# EAGLE design H18R10 (EAGLE 9.6.2)

## Sheet 1 of 2
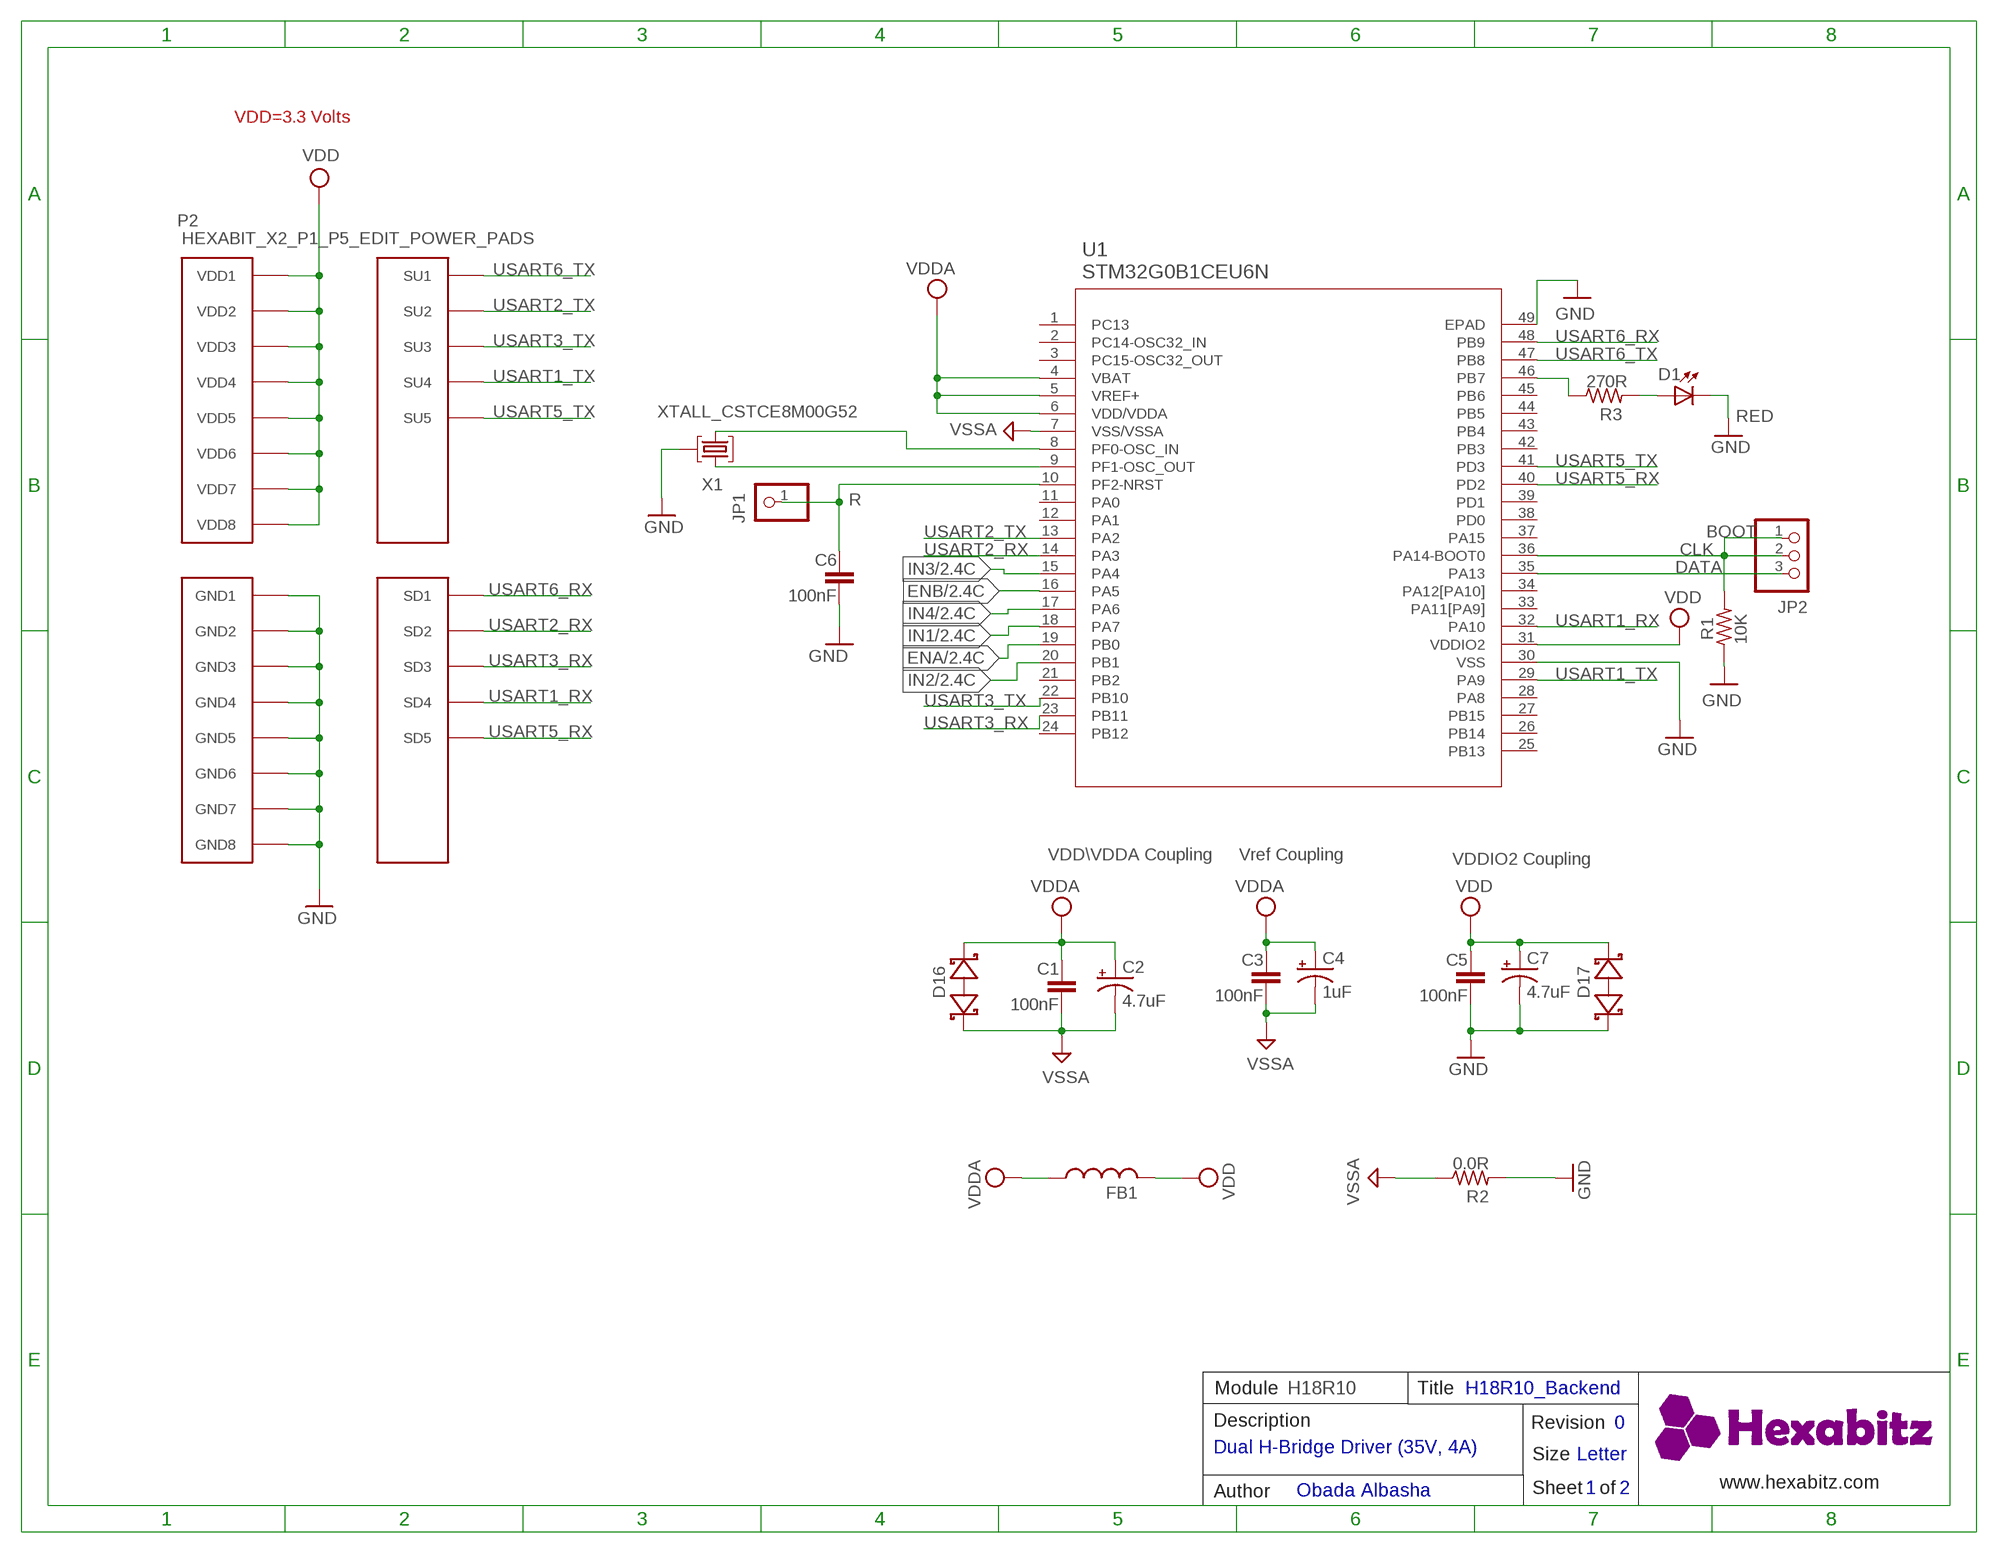
[diagram p0: schematic, sheet 1]

### Parts
C1  100nF  C-0603  [C-0603]
C2  4.7uF  C-0805-POL  [C-0805-POL]
C3  100nF  C-0603  [C-0603]
C4  1uF  C-0805-POL  [C-0805-POL]
C5  100nF  C-0603  [C-0603]
C6  100nF  C-0603  [C-0603]
C7  4.7uF  C-0805-POL  [C-0805-POL]
D1  RED  VLMS1300-GS08  [VLMS1300-GS08]
D16  BOURNS_CDSOD323-T03SCBOURNS_CDSOD323-T03SC_0_0  [BOURNS_CDSOD323-T03SC_0]
D17  BOURNS_CDSOD323-T03SCBOURNS_CDSOD323-T03SC_0_0  [BOURNS_CDSOD323-T03SC_0]
FB1  FB-0603  [FB-0603]
JP1  R  PINHD-1X1  [1X01]
JP2  PINHD-1X3  [1X03]
P2  HEXABIT_X2_P1_P5_EDIT_POWER_PADS  [HEXABIT_X2_P1_P5_EDIT_POWER_PADS]
R1  10K  R-0603  [R-0603]
R2  0.0R  R-0603  [R-0603]
R3  270R  R-0603  [R-0603]
U1  STM32G0B1CEU6N  [HEXABITZ_ICS_QFN_B1CEU6_STM-L]
X1  XTALL_CSTCE8M00G52  [XTALL_CSTCE8M00G52]

### Nets
CLK: JP2.1 JP2.2 R1.2 U1.36(PA14-BOOT0)
DATA: JP2.3 U1.35(PA13)
ENA: U1.19(PB0) ; also sheet 2
ENB: U1.16(PA5) ; also sheet 2
GND: C5.2 C6.2 C7.2(-) D1.C D17.1(A) P2.PAD_PD11(GND1) P2.PAD_PD12(GND2) P2.PAD_PD13(GND3) P2.PAD_PD14(GND4) P2.PAD_PD17(GND5) P2.PAD_PD18(GND6) P2.PAD_PD19(GND7) P2.PAD_PD20(GND8) R1.1 R2.2 U1.30(VSS) U1.49(EPAD) X1.P$2
IN1: U1.18(PA7) ; also sheet 2
IN2: U1.20(PB1) ; also sheet 2
IN3: U1.15(PA4) ; also sheet 2
IN4: U1.17(PA6) ; also sheet 2
N$1: D1.A R3.2
N$2: R3.1 U1.46(PB7)
N$5: U1.9(PF1-OSC_OUT) X1.P$1
N$6: U1.8(PF0-OSC_IN) X1.P$3
N$8: C6.1 JP1.1 U1.10(PF2-NRST)
USART1_RX: P2.PAD_PD4(SD4) U1.32(PA10)
USART1_TX: P2.PAD_PU4(SU4) U1.29(PA9)
USART2_RX: P2.PAD_PD2(SD2) U1.14(PA3)
USART2_TX: P2.PAD_PU2(SU2) U1.13(PA2)
USART3_RX: P2.PAD_PD3(SD3) U1.23(PB11)
USART3_TX: P2.PAD_PU3(SU3) U1.22(PB10)
USART5_RX: P2.PAD_PD5(SD5) U1.40(PD2)
USART5_TX: P2.PAD_PU5(SU5) U1.41(PD3)
USART6_RX: P2.PAD_PD1(SD1) U1.48(PB9)
USART6_TX: P2.PAD_PU1(SU1) U1.47(PB8)
VDD: C5.1 C7.1(+) D17.2(C) FB1.2 P2.PAD_PU11(VDD1) P2.PAD_PU12(VDD2) P2.PAD_PU13(VDD3) P2.PAD_PU14(VDD4) P2.PAD_PU17(VDD5) P2.PAD_PU18(VDD6) P2.PAD_PU19(VDD7) P2.PAD_PU20(VDD8) U1.31(VDDIO2)
VDDA: C1.1 C2.1(+) C3.1 C4.1(+) D16.2(C) FB1.1 U1.4(VBAT) U1.5(VREF+) U1.6(VDD/VDDA) ; also sheet 2
VSSA: C1.2 C2.2(-) C3.2 C4.2(-) D16.1(A) R2.1 U1.7(VSS/VSSA) ; also sheet 2
Unconnected: U1.1(PC13) U1.2(PC14-OSC32_IN) U1.3(PC15-OSC32_OUT) U1.11(PA0) U1.12(PA1) U1.21(PB2) U1.24(PB12) U1.25(PB13) U1.26(PB14) U1.27(PB15) U1.28(PA8) U1.33(PA11[PA9]) U1.34(PA12[PA10]) U1.37(PA15) U1.38(PD0) U1.39(PD1) U1.42(PB3) U1.43(PB4) U1.44(PB5) U1.45(PB6)

### Notes on the sheet
- VDD=3.3 Volts
- BOOT
- VDD\VDDA Coupling | Vref Coupling | VDDIO2 Coupling
- Module | H18R10 | Title | H18R10_Backend
- Description | Revision | 0
- Dual H-Bridge Driver (35V, 4A)
- Size | Letter
- www.hexabitz.com
- Author | Obada Albasha | Sheet   of | 1 | 2
- C:/Users/Admin/Desktop/logodraft.bmp

## Sheet 2 of 2
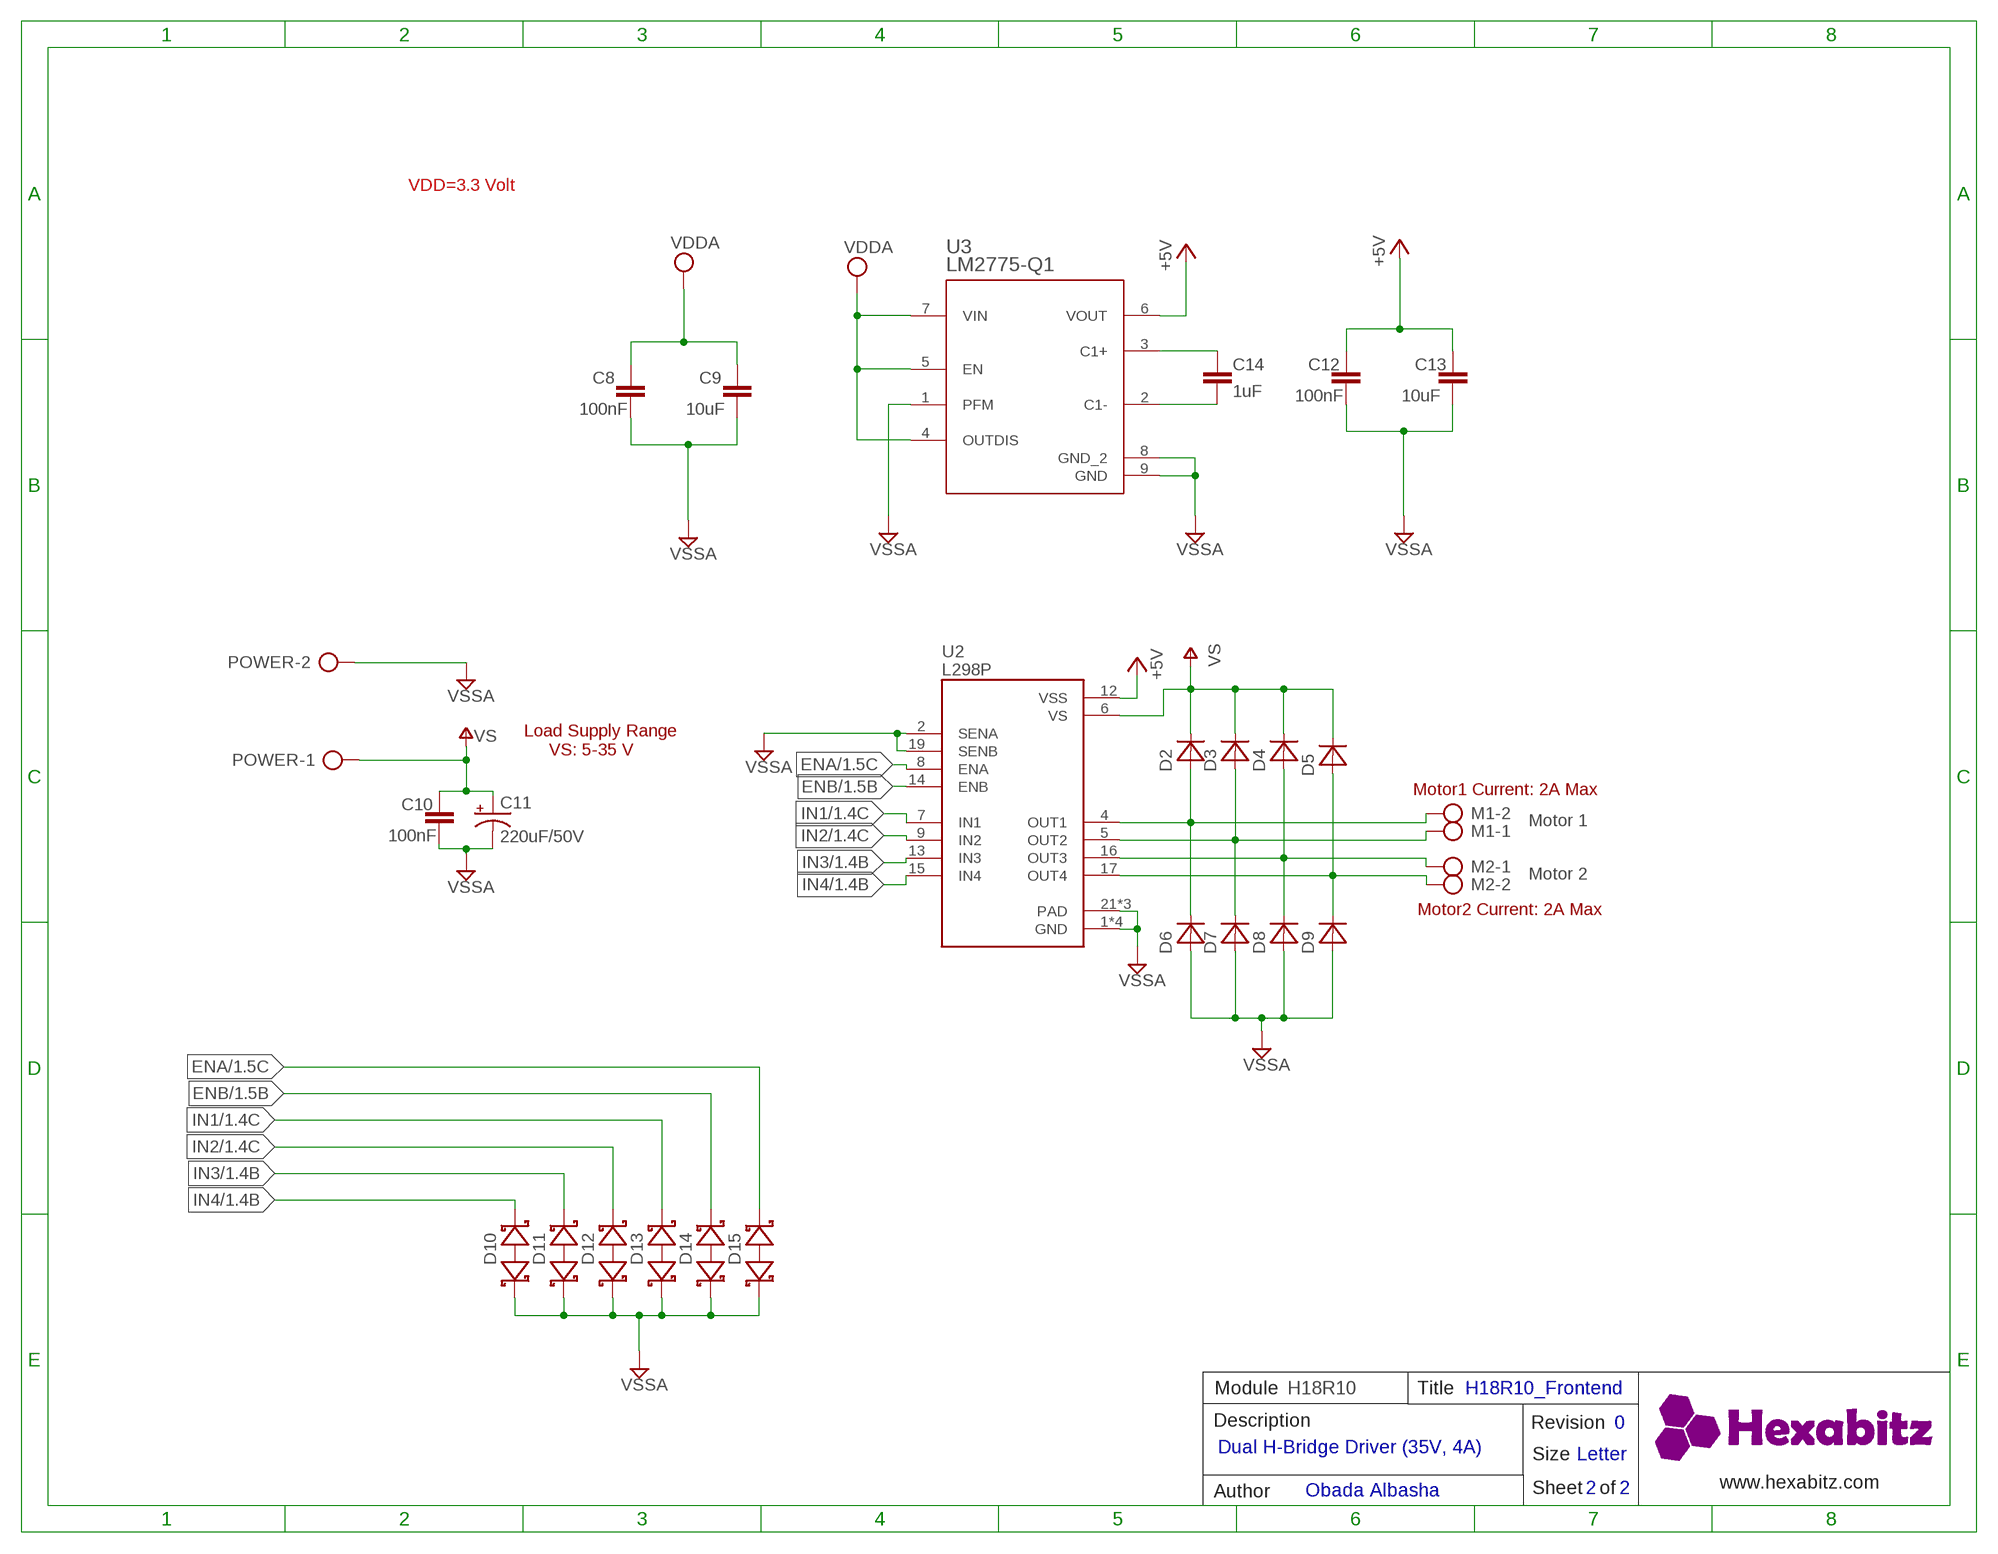
[diagram p1: schematic, sheet 2]

### Parts
C8  100nF  C-0603  [C-0603]
C9  10uF  C-0603  [C-0603]
C10  100nF  C-0603  [C-0603]
C11  220uF/50V  CPOL-USTT5D10  [TT5D10]
C12  100nF  C-0603  [C-0603]
C13  10uF  C-0603  [C-0603]
C14  1uF  C-0603  [C-0603]
D2  DIOD-SOD-123  [SOD123]
D3  DIOD-SOD-123  [SOD123]
D4  DIOD-SOD-123  [SOD123]
D5  DIOD-SOD-123  [SOD123]
D6  DIOD-SOD-123  [SOD123]
D7  DIOD-SOD-123  [SOD123]
D8  DIOD-SOD-123  [SOD123]
D9  DIOD-SOD-123  [SOD123]
D10  BOURNS_CDSOD323-T03SCBOURNS_CDSOD323-T03SC_0_0  [BOURNS_CDSOD323-T03SC_0]
D11  BOURNS_CDSOD323-T03SCBOURNS_CDSOD323-T03SC_0_0  [BOURNS_CDSOD323-T03SC_0]
D12  BOURNS_CDSOD323-T03SCBOURNS_CDSOD323-T03SC_0_0  [BOURNS_CDSOD323-T03SC_0]
D13  BOURNS_CDSOD323-T03SCBOURNS_CDSOD323-T03SC_0_0  [BOURNS_CDSOD323-T03SC_0]
D14  BOURNS_CDSOD323-T03SCBOURNS_CDSOD323-T03SC_0_0  [BOURNS_CDSOD323-T03SC_0]
D15  BOURNS_CDSOD323-T03SCBOURNS_CDSOD323-T03SC_0_0  [BOURNS_CDSOD323-T03SC_0]
M1  AK500/2  [AK500/2]
M2  AK500/2  [AK500/2]
POWER  AK500/2  [AK500/2]
U2  L298P  [SOIC127P1420X360-20N]
U3  LM2775-Q1  LM2775QDSGRQ1  [DSG0008A]

### Nets
+5V: C12.1 C13.1 U2.12(VSS) U3.6(VOUT)
ENA: D15.2(C) U2.8(ENA) ; also sheet 1
ENB: D14.2(C) U2.14(ENB) ; also sheet 1
IN1: D13.2(C) U2.7(IN1) ; also sheet 1
IN2: D12.2(C) U2.9(IN2) ; also sheet 1
IN3: D11.2(C) U2.13(IN3) ; also sheet 1
IN4: D10.2(C) U2.15(IN4) ; also sheet 1
N$3: C14.2 U3.2(C1-)
N$4: C14.1 U3.3(C1+)
N$7: D5.1(A) D9.2(C) M2.2 U2.17(OUT4)
N$13: D3.1(A) D7.2(C) M1.1 U2.5(OUT2)
N$14: D4.1(A) D8.2(C) M2.1 U2.16(OUT3)
N$15: D2.1(A) D6.2(C) M1.2 U2.4(OUT1)
V+: C10.1 C11.+ D2.2(C) D3.2(C) D4.2(C) D5.2(C) POWER.1 U2.6(VS) ; supply symbol labelled VS
VDDA: C8.1 C9.1 U3.4(OUTDIS) U3.5(EN) U3.7(VIN) ; also sheet 1
VSSA: C8.2 C9.2 C10.2 C11.- C12.2 C13.2 D6.1(A) D7.1(A) D8.1(A) D9.1(A) D10.1(A) D11.1(A) D12.1(A) D13.1(A) D14.1(A) D15.1(A) POWER.2 U2.1(GND) U2.2(SENA) U2.10(GND) U2.11(GND) U2.19(SENB) U2.20(GND) U2.21(PAD) U2.22(PAD) U2.23(PAD) U3.1(PFM) U3.8(GND_2) U3.9(GND) ; also sheet 1

### Notes on the sheet
- VDD=3.3 Volt
- Load Supply Range
       VS: 5-35 V
- Motor1 Current: 2A Max
- Motor 1
- Motor 2
- Motor2 Current: 2A Max
- Module | H18R10 | Title | H18R10_Frontend
- Description | Revision | 0
- Dual H-Bridge Driver (35V, 4A)
- Size | Letter
- www.hexabitz.com
- Author | Obada Albasha | Sheet   of | 2 | 2
- C:/Users/Admin/Desktop/logodraft.bmp

## Library data of the parts
C1 C3 C5 C6 C8-C10 C12-C14 = HEXABITZ_RCLS:C-0603: CAP CER 10% X7R 0603
C2 C4 C7 = HEXABITZ_RCLS:C-0805-POL: Cap Tant Solid SMD 2012
C11 = rcl:CPOL-US: POLARIZED CAPACITOR, American symbol; SPICEPREFIX: C
D1 = Hexabitz:VLMS1300-GS08: Red 0603 130° Clear 54 mcd 2 V Surface Mount ChipLED ; Octopart Url : http://octopart.com/vlms1300-gs08-vishay-21709201; MFN: Vishay; MPN: VLMS1300-GS08; OCTOPART_URL: https://octopart.com/vlms1300-gs08-vishay-21709201?r=sp&s=_gcP4_q8T1SC6PJQPTQ9yA
D2-D9 = HEXABITZ_RCLS:DIOD-SOD-123: 1.0 A Surface Mount Schottky Barrier Rectifier, 40 V, -65 to 125 degC, 2-Pin SOD-123 Package, RoHS, Tape and Reel
D10-D17 = HEXABITZ_RCLS:BOURNS_CDSOD323-T03SC: CDSOD323-TxxSC - TVS Diode Series; DESCRIPTION: Dio Tvs Vwm 03V 500W Bidir Sod323 / Tape & Reel - 7" Reel; MFN: Bourns; MPN: CDSOD323-T03SC; OCTOPART_URL: https://octopart.com/cdsod323-t03sc-bourns-10487153?r=sp
FB1 = HEXABITZ_RCLS:FB-0603: Ferrite Beads Multi-Layer 0603
JP1 = HEXABITZ_USER_INTERFACE_PARTS:PINHD-1X1: PIN HEADER; MFN: TE Connectivity; MPN: 87227-1; OCTOPART_URL: https://octopart.com/87227-1-te+connectivity-39512052?r=sp
JP2 = pinhead:PINHD-1X3: PIN HEADER
M1 M2 POWER = HEXABITZ_CONNECTION_PARTS:AK500/2: CONNECTOR; MFN: TE Connectivity; MPN: 282836-2; OCTOPART_URL: https://octopart.com/282836-2-te+connectivity-39396934?r=sp
P2 = hexabitz_connectors:HEXABIT_X2_P1_P5_EDIT_POWER_PADS
R1-R3 = HEXABITZ_RCLS:R-0603: Thick Film Resistors - SMD 0603
U1 = HEXABITZ_ICs:STM32G0B1CEU6N
U2 = HEXABITZ_ICs:L298P: L298 Series Dual Full Bridge 4 A 46 V Driver Surface Mount - PowerSO-20 Check availability <https://pricing.snapeda.com/parts/L298P/STMicroelectronics/view-part?ref=eda>; AVAILABILITY: In Stock; DESCRIPTION: Half Bridge (4) Driver DC Motors, Relays, Solenoids, Stepper Motors Bipolar PowerSO-20; MF: STMicroelectronics; MP: L298P; PACKAGE: SO-20 STMicroelectronics; PRICE: None; PURCHASE-URL: https://pricing.snapeda.com/search/part/L298P/?ref=eda
U3 = HEXABITZ_ICs:LM2775QDSGRQ1: Switched Capacitor 5V Boost Converter 8-WSON -40 to 125; MANUFACTURER: Texas Instruments; MFN: Texas Instruments; MPN: LM2775QDSGRQ1; OCTOPART_URL: https://octopart.com/lm2775qdsgrq1-texas+instruments-93339195?r=sp&s=OA7oim0HQqaBsU4tLKFWXg LM2775QDSGRQ1; PARTNUMBER: LM2775QDSGRQ1; REFDES: RefDes; TYPE: TYPE
X1 = Hexabitz:XTALL_CSTCE8M00G52: MURATA CSTCE8M00G52-R0 RESONATOR, SMD, 8MHZ ; Octopart Url : https://octopart.com/cstce8m00g52-r0-murata-7145559; MFN: Murata; MPN: CSTCE8M00G52Z-R0; OCTOPART_URL: https://octopart.com/cstce8m00g52z-r0-murata-17755941?r=sp&s=JDnNJnrHQhyS8Zk4ofFWXw

## Board
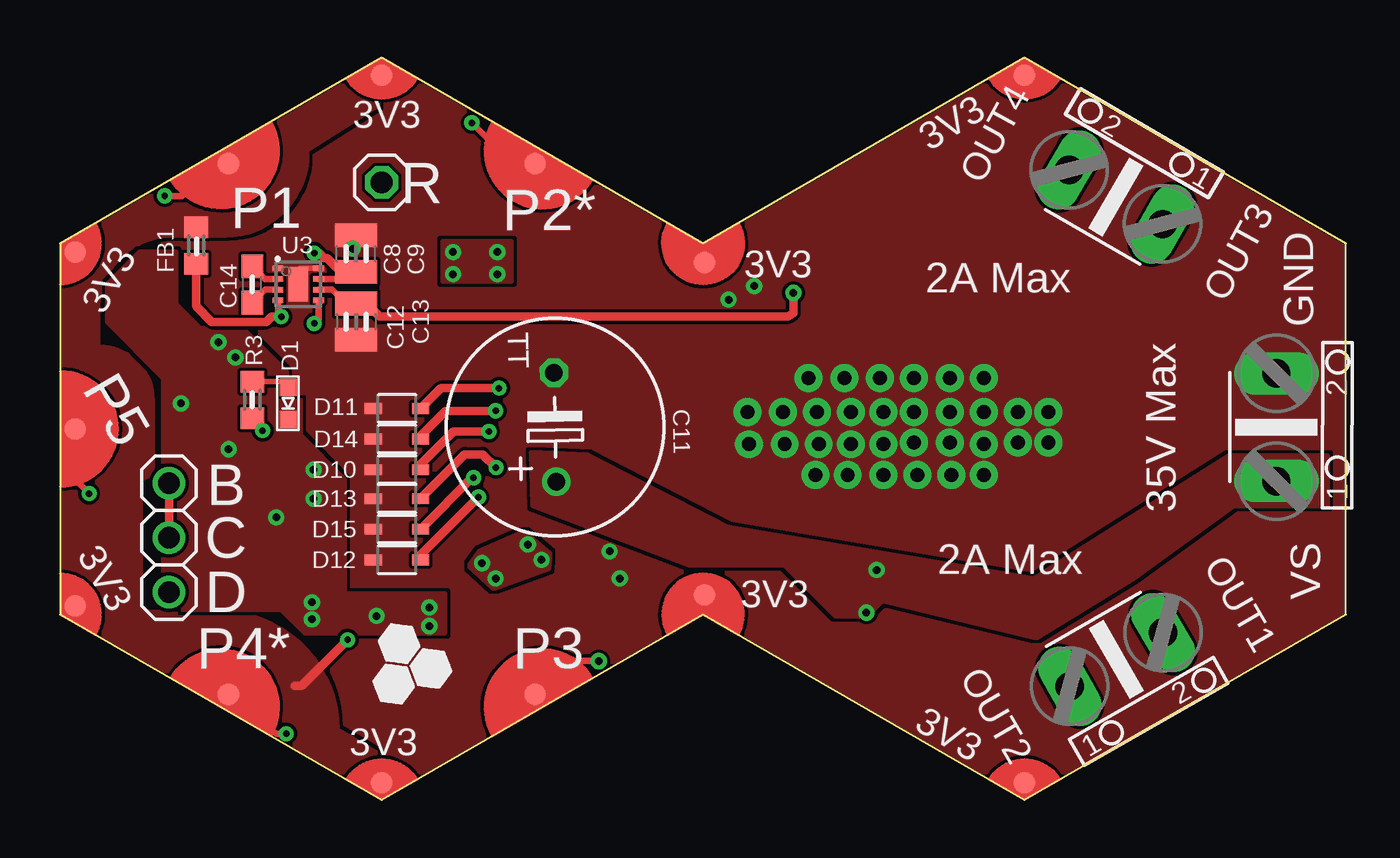
[diagram p2: board, top side]
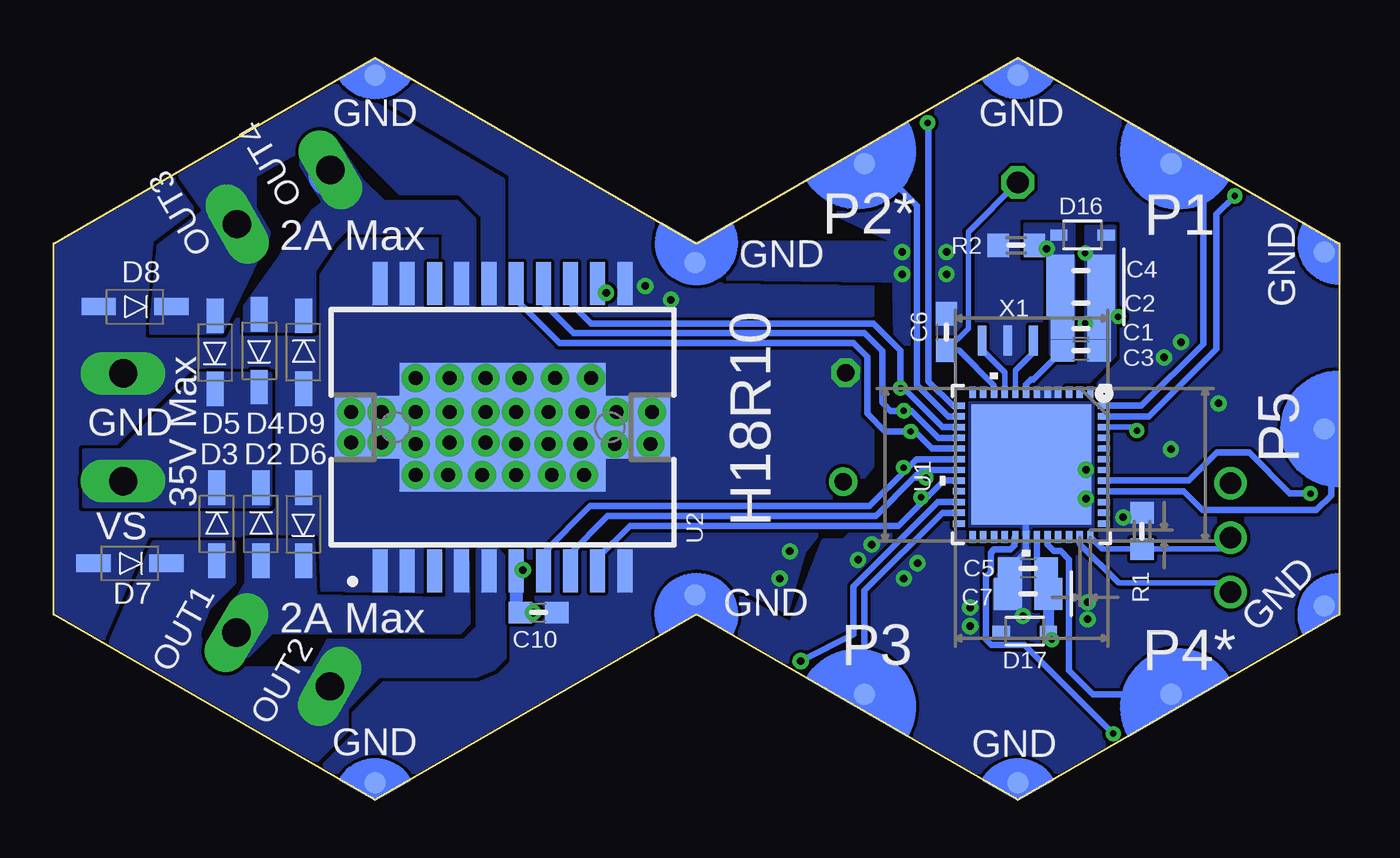
[diagram p3: board, bottom side, seen from below]

Size 60 x 34.64 mm. Coordinates in mm from the lower left corner, seen from the top.
Copper layers (1*16): Top 0.035mm / dielectric 1.5mm / Bottom 0.035mm
Design rules "default *": minimum track width 6mil, minimum drill 0.3mm, track to track 6mil, track to pad 6mil, pad to pad 6mil, via to via 6mil, smd to smd 0mil, copper to edge 1mil, drill to drill 6mil, minimum pad ring 10mil, minimum via ring 8mil, stop-mask expansion 4mil, vias tented up to drill 24mil, thermal gap 10mil

### Footprints (pad centres in the part's own frame; a part is rotated, then mirrored left to right if it is on the bottom)
C-0603 = smd 1.1 x 1: 1 -0.85,0; 2 0.85,0
C-0805-POL = smd 1.3 x 1.5: 1 -0.95,0; 2 0.95,0
TT5D10 = drill 0.813: + -2.54,0 | drill 0.813 octagon: - 2.54,0
VLMS1300-GS08 = smd 0.8 x 0.8: A 0,0.75; C 0,-0.75
SOD123 = smd 1.6 x 0.8: 1 -1.7,0; 2 1.7,0
BOURNS_CDSOD323-T03SC_0 = smd 0.8 x 0.5: 1 -1.1,0; 2 1.1,0
FB-0603 = smd 1 x 1.1: 1 -0.85,0; 2 0.85,0
1X01 = drill 1.016 octagon: 1 0,0
1X03 = drill 1.016: 1 -2.54,0; 2 0,0; 3 2.54,0
AK500/2 = drill 1.321 long: 1 -2.515,0; 2 2.515,0
HEXABIT_X2_P1_P5_EDIT_POWER_PADS = smd 1 x 1 bottom: PAD_PD1 12.39,22.39; PAD_PD2 12.39,8.09; PAD_PD3 -12.39,8.09; PAD_PD4 -12.39,22.39; PAD_PD5 0,29.55; PAD_PD12 16.52,15.24; PAD_PD13 7.752,0.168; PAD_PD14 16.52,-14.76; PAD_PD17 -16.52,-14.76; PAD_PD18 -7.752,0.168; PAD_PD19 -16.52,15.24 | smd 1 x 1 rotated 60 bottom: PAD_PD11 8.26,29.547 | smd 1 x 1 rotated 120 bottom: PAD_PD20 -8.26,29.547 | smd 1 x 1: PAD_PU1 12.39,22.39; PAD_PU2 12.39,8.09; PAD_PU3 -12.39,8.09; PAD_PU4 -12.39,22.39; PAD_PU5 0,29.55; PAD_PU12 16.52,15.24; PAD_PU13 7.752,0.168; PAD_PU14 16.52,-14.76; PAD_PU17 -16.52,-14.76; PAD_PU18 -7.752,0.168; PAD_PU19 -16.52,15.24 | smd 1 x 1 rotated 60: PAD_PU11 8.26,29.547 | smd 1 x 1 rotated 120: PAD_PU20 -8.26,29.547
R-0603 = smd 1 x 1.1: 1 -0.85,0; 2 0.85,0
HEXABITZ_ICS_QFN_B1CEU6_STM-L = smd 0.55 x 0.297: 1 -3.38,2.751; 2 -3.38,2.251; 3 -3.38,1.75; 4 -3.38,1.25; 5 -3.38,0.75; 6 -3.38,0.25; 7 -3.38,-0.25; 8 -3.38,-0.75; 9 -3.38,-1.25; 10 -3.38,-1.75; 11 -3.38,-2.251; 12 -3.38,-2.751; 25 3.38,-2.751; 26 3.38,-2.251; 27 3.38,-1.75; 28 3.38,-1.25; 29 3.38,-0.75; 30 3.38,-0.25; 31 3.38,0.25; 32 3.38,0.75; 33 3.38,1.25; 34 3.38,1.75; 35 3.38,2.251; 36 3.38,2.751 | smd 0.297 x 0.55: 13 -2.751,-3.38; 14 -2.251,-3.38; 15 -1.75,-3.38; 16 -1.25,-3.38; 17 -0.75,-3.38; 18 -0.25,-3.38; 19 0.25,-3.38; 20 0.75,-3.38; 21 1.25,-3.38; 22 1.75,-3.38; 23 2.251,-3.38; 24 2.751,-3.38; 37 2.751,3.38; 38 2.251,3.38; 39 1.75,3.38; 40 1.25,3.38; 41 0.75,3.38; 42 0.25,3.38; 43 -0.25,3.38; 44 -0.75,3.38; 45 -1.25,3.38; 46 -1.75,3.38; 47 -2.251,3.38; 48 -2.751,3.38 | smd 5.6 x 5.6: 49 0,0
SOIC127P1420X360-20N = smd 2 x 0.7: 1 -6.7,5.715; 2 -6.7,4.445; 3 -6.7,3.175; 4 -6.7,1.905; 5 -6.7,0.635; 6 -6.7,-0.635; 7 -6.7,-1.905; 8 -6.7,-3.175; 9 -6.7,-4.445; 10 -6.7,-5.715; 11 6.7,-5.715; 12 6.7,-4.445; 13 6.7,-3.175; 14 6.7,-1.905; 15 6.7,-0.635; 16 6.7,0.635; 17 6.7,1.905; 18 6.7,3.175; 19 6.7,4.445; 20 6.7,5.715 | smd 6 x 9.6: 21 0,0 | smd 2.9 x 3.05: 22 0,6.3; 23 0,-6.3
DSG0008A = smd 0.5 x 0.25: 1 -0.95,0.75; 2 -0.95,0.25; 3 -0.95,-0.25; 4 -0.95,-0.75; 5 0.95,-0.75; 6 0.95,-0.25; 7 0.95,0.25; 8 0.95,0.75 | smd 0.9 x 1.6: 9 0,0
XTALL_CSTCE8M00G52 = smd 1.4 x 0.4: P$1 0,1.2; P$2 0,0; P$3 0,-1.2

### Placement (x,y rotation side)
C1  12.06,22 180 bottom
C2  12.06,23.19 180 bottom
C3  12.06,20.97 180 bottom
C4  12.06,24.7 180 bottom
C5  14.52,10.81 180 bottom
C6  18.33,21.84 90 bottom
C7  14.52,9.62 180 bottom
C8  13.33,25.5 90 top
C9  14.29,25.5 90 top
C10  37.37,8.75 0 bottom
C11  23.1,17.4 91.2 top
C12  13.33,22.32 270 top
C13  14.29,22.32 270 top
C14  8.97,24.07 90 top
D1  10.63,18.51 0 top
D2  50.32,12.88 90 bottom
D3  52.39,12.88 90 bottom
D4  52.47,20.89 270 bottom
D5  50.4,20.97 270 bottom
D6  48.34,12.88 270 bottom
D7  56.43,11.05 0 bottom
D8  56.2,23.04 0 bottom
D9  48.34,20.89 90 bottom
D10  15.71,15.42 0 top
D11  15.71,18.27 0 top
D12  15.71,11.21 0 top
D13  15.71,14.07 0 top
D14  15.71,16.84 0 top
D15  15.71,12.64 0 top
D16  11.98,26.37 0 bottom
D17  14.68,7.87 0 bottom
FB1  6.34,25.88 90 top
JP1  15,28.83 0 top
JP2  5.08,12.24 270 top
M1  49.29,6.56 29.9 top
M2  49.26,28.14 149.9 top
P2  30.24,17.32 90 top
POWER  56.75,17.4 90 top
R1  9.21,12.56 270 bottom
R2  15.08,25.89 180 bottom
R3  8.97,18.67 90 top
U1  14.36,15.65 270 bottom
U2  39.05,17.4 90 bottom
U3  11.11,24.07 0 top
X1  15.48,21.45 90 bottom

### Tracks (layer width: path | path; a pad name or v marks a point on that pad's centre or on a via)
+5V  (via drill 0.35 pad 0.75)
  Top 0.305: U3.6 12.68,23.82 12.71,23.79 C12.1
  Top 0.406: v34.22,23.67 34.22,22.72 33.97,22.57 14.9,22.56 C13.1
  Top 0.508: C13.1 C12.1
  Bottom 0.406: v34.22,23.67 34.61,24.06 U2.12
CLK
  Top 0.406: JP2.1 JP2.2
  Bottom 0.254: JP2.2 5.61,11.71 R1.2 11.05,11.71 U1.36
DATA
  Bottom 0.254: U1.35 12.12,11.96 10.29,10.13 5.51,10.13 JP2.3
ENA  (via drill 0.3 pad 0.55)
  Top 0.406: D15.2 19.22,15.04 v19.29,15.04
  Bottom 0.305: U1.19 19.48,15.4 19.84,15.04 | U2.8 35.95,10.78 35.95,11.45 34.14,13.26 21.62,13.26 19.84,15.04 | 19.84,15.04 v19.29,15.04
ENB  (via drill 0.3 pad 0.55)
  Top 0.406: v20.32,18.16 17.98,18.16 16.81,17 D14.2
  Bottom 0.305: U1.16 18.7,16.9 19.96,18.16 v20.32,18.16 20.95,18.16 21.33,18.55 21.33,20.95 22.16,21.78 35.74,21.78 37.3,23.35 37.3,23.94 U2.14
GND  (via drill 0.35 pad 0.75)
  Bottom 0.305: C7.2 15.47,10.71 C5.2 14.61,11.57 U1.30 14.61,15.4 U1.49
  other vias: 11.75,9.22 11.75,8.43 17.22,8.99 17.22,8.11 14.76,8.59 11.82,15.42 11.82,14.07 5.63,18.51 7.86,16.37 7.38,21.37 8.17,20.65 20.4,24.54 20.4,25.57 18.33,25.57 18.33,24.54 19.68,11.05 20.32,10.34 21.83,11.92 22.46,11.21 10.08,13.19
  pour Bottom (rank 2, no thermals): 25.79,28.49 15.08,34.62 0.16,26.05 0.08,8.75 15,0.02 25.79,6.18 23.89,11.21 20.48,14.62 20.71,26.13
  pour Top (no thermals): 17.94,7.8 17.94,9.62 13.25,9.62 13.25,14.94 11.19,17 11.19,19.3 8.49,22 6.51,22 5.4,23.11 5.4,25.57 3.73,25.57 2.22,24.07 2.22,22.32 4.84,19.7 4.84,8.91 10.32,8.91 11.43,7.8
  pour Bottom (no thermals): 45,34.62 30,25.97 17.7,25.97 17.7,24.23 30.52,24.38 46.41,33.82
  pour Top (no thermals): 17.86,26.05 17.86,24.23 21.03,24.23 21.03,26.05
  pour Bottom (rank 2, no thermals): 14.92,0.02 30,8.67 45,0.02 47.15,1.29 29.91,10.5 25.56,8.19 24.05,12.08 19.37,12.16 14.52,1.84 14.92,0.1
  pour Top: 21.64,12.5 22.86,11.49 22.78,10.81 20.21,9.88 19.08,10.93 19.56,11.6
IN1  (via drill 0.3 pad 0.55)
  Top 0.406: D13.2 18.88,16.13 19.72,16.13 v20.34,15.51
  Bottom 0.305: U2.7 37.15,11.53 34.96,13.72 21.92,13.72 20.23,15.4 | 20.23,15.4 19.73,15.9 U1.18 | 20.23,15.4 v20.34,15.51
IN2  (via drill 0.3 pad 0.55)
  Top 0.406: v19.51,14.13 16.81,11.43 D12.2
  Bottom 0.254: 34.68,10.89 34.61,10.81 U2.9
  Bottom 0.305: U1.20 18.46,14.9 19.25,14.11 | 19.25,14.11 20.56,12.8 33.09,12.8 34.61,11.29 U2.9 | 19.25,14.11 19.27,14.13 v19.51,14.13
IN3  (via drill 0.3 pad 0.55)
  Top 0.406: v20.48,19.22 17.77,19.22 D11.2
  Bottom 0.305: U2.13 36.03,23.94 36.03,23.35 34.93,22.24 21.75,22.24 20.48,20.97 v20.48,19.22 20.34,19.22 18.52,17.4 U1.15
IN4  (via drill 0.3 pad 0.55)
  Top 0.406: v20,17.2 18.36,17.2 16.81,15.65 D10.2
  Bottom 0.305: U2.15 38.44,24.08 38.44,23.37 36.39,21.33 22.68,21.33 22.03,20.67 22.03,18.03 21.19,17.2 v20,17.2 19.81,17.2 19.01,16.4 U1.17
N$1
  Top 0.254: R3.2 10.38,19.52 D1.A
N$2  (via drill 0.3 pad 0.55)
  Top 0.254: R3.1 9.44,17.34 v9.44,17.24
  Bottom 0.254: v9.44,17.24 9.61,17.4 U1.46
N$3
  Top 0.305: C14.2 9.57,24.32 U3.2
N$4
  Top 0.305: C14.1 9.57,23.82 U3.3
N$5
  Bottom 0.254: X1.P$1 16.68,21.02 15.61,19.95 15.61,19.04 U1.9
N$6
  Bottom 0.254: X1.P$3 14.28,20.89 15.11,20.05 U1.8
N$7
  Top 1.016: 47.02,29.43 M2.2
  Bottom 1.016: 47.34,29.43 M2.2 47.1,29.34
  Bottom 2.032: 47.09,29.17 M2.2
  pour Bottom (no thermals): 41.75,23.04 41.75,26.45 41.83,26.53 46.04,26.53 47.27,27.76 48.46,29.72 46.77,30.61 45.64,28.91 44.61,27.88 41.19,27.88 40.4,27.08 40.4,23.11 40.48,23.04
  pour Bottom (no thermals): 51.04,21.92 51.04,23.04 47.86,27.48 46.51,28.51 45.56,27.48 46.9,26.14 47.86,24.71 47.86,21.92
N$8
  Bottom 0.254: U1.10 16.11,19.04 16.11,19.34 17.76,20.99 C6.1 17.31,22.01 17.31,26.51 JP1.1
N$13
  pour Bottom (no thermals): 48.97,4.14 47.18,7.4 40.8,7.4 40.16,8.03 40.16,11.68 39.37,11.68 38.97,11.29 38.97,6.68 39.52,6.14 40.31,5.81 44.84,5.81 47.15,3.51 48.02,3.51 48.73,4.22 47.07,7.24
  pour Bottom (no thermals): 51.59,12 51.59,10.18 52.8,8.96 53.23,7.84 arc-90 51.51,6.13 47.78,6.13 arc90 46.35,4.7 46.35,3.27 47.78,1.84 57.36,7.25 55.31,12
N$14
  pour Bottom (no thermals): 39.92,23.11 39.92,27.24 41.03,28.35 43.81,28.35 46.83,31.37 48.81,30.18 50.64,29.15 50.64,26.47 50.33,25.93 51.5,25.2 52.54,26.77 53.1,27.72 54.21,29.31 46.87,33.57 39.05,28.92 39.05,23.11
  pour Bottom (no thermals): 50.96,28.19 49.96,26.45 52.19,21.84 55.44,21.84 55.08,25.86 51.24,28.73
N$15
  Bottom 1.524: M1.2 51.3,7.64
  pour Bottom (no thermals): 40.72,11.68 40.66,8.25 41.03,7.87 49.85,7.87 50.94,6.78 52.23,6.78 52.59,7.37 50.96,10.13 50.96,12.08 47.9,12.08 47.81,9.47 41.59,9.36 41.59,11.68
USART1_RX
  Bottom 0.305: P2.PAD_PD4 11.5,4.93 12.62,6.05 12.62,11.24 13,11.62 13.31,11.62 13.61,11.92 U1.32
USART1_TX  (via drill 0.3 pad 0.55)
  Top 0.305: v10.55,3.09 10.09,3.09 9.12,3.65 P2.PAD_PU4
  Bottom 0.305: U1.29 15.16,12.23 15.16,11.87 15.35,11.68 16.11,11.68 16.27,11.53 16.27,10.66 16.49,10.44 16.49,7.5 16.23,7.24 14.69,7.24 v10.55,3.09
USART2_RX
  Bottom 0.305: P2.PAD_PD2 21.67,29.71 19.7,27.74 19.7,19.36 18.25,17.9 U1.14
USART2_TX  (via drill 0.3 pad 0.55)
  Top 0.305: P2.PAD_PU2 22.15,29.46 21.35,29.46 v19.21,31.61
  Bottom 0.305: v19.21,31.61 19.17,31.57 19.17,19.54 18.03,18.4 U1.13
USART3_RX
  Bottom 0.305: P2.PAD_PD3 22.15,9.77 18.52,13.4 U1.23
USART3_TX  (via drill 0.35)
  Top 0.305: v25.13,6.48 23.7,6.48 P2.PAD_PU3
  Bottom 0.305: v25.13,6.48 22.66,7.73 22.67,9.97 18.73,13.9 U1.22
USART5_RX
  Bottom 0.305: P2.PAD_PD5 0.37,17 0.37,14.22 1.07,13.53 6.38,13.53 7.25,14.4 U1.40
USART5_TX  (via drill 0.3 pad 0.55)
  Top 0.305: v1.35,14.3 0.69,14.96 P2.PAD_PU5
  Bottom 0.305: v1.35,14.3 2.3,14.3 4.2,16.21 5.72,16.21 7.02,14.9 U1.41
USART6_RX
  Bottom 0.305: P2.PAD_PD1 6.35,28.21 6.35,21.29 9.23,18.4 U1.48
USART6_TX  (via drill 0.3 pad 0.55)
  Top 0.305: P2.PAD_PU1 7.21,29.07 6.55,29.07 5.67,28.19 v4.87,28.19
  Bottom 0.305: v4.87,28.19 5.73,27.33 5.73,21.05 8.88,17.9 U1.47
V+  (via drill 0.35 pad 0.75)
  Bottom 0.508: v38.1,10.73 38.38,10.73 U2.6
  Bottom 0.61: C10.1 v37.62,8.75 | U2.6 38.42,9.22
  pour Top (no thermals): 59.13,16.05 59.13,13.75 54.77,13.75 50.08,10.34 45.56,7.56 38.34,9.3 37.62,8.59 36.19,8.59 33.81,10.97 29.37,10.97 22.06,13.75 21.98,16.21 24.62,16.11 31.19,12.72 45.45,10.33 54.53,16.05
  pour Bottom (no thermals): 58.55,13.75 50,13.75 49.92,13.83 49.92,19.86 53.26,19.86 56.83,16.29 58.55,16.29
VDD  (via drill 0.3 pad 0.55)
  Top 0.406: v13.41,7.48 11.27,5.33 10.95,5.33
  Bottom 0.305: U1.31 14.11,11.25 13.57,10.71
  Bottom 0.406: D17.2 13.58,7.65 v13.41,7.48
  Bottom 0.508: D17.2 C7.1 13.57,10.71 C5.1
  pour Top (rank 2, no thermals): -1.51,25.1 -1.51,9.59 14.92,0.02 30,8.59 44.92,0.1 46.59,0.97 arc90 45.4,2.16 45.08,2.16 30.24,10.34 26.35,8.27 21.51,8.27 19.45,7.16 15.18,1.94 12.92,3.28 arc90 7.46,8.75 3.73,8.75 3.73,15.02 arc90 4.28,15.57 4.28,18.67 arc90 1.82,21.13 1.74,21.13 1.74,22.88 arc-90 5.24,26.37 7.7,26.37 arc90 11.51,30.18 11.51,30.34 15.03,32.56 16.31,31.78 19.91,25.97 26.39,25.97 29.76,24.15 45.08,32.72 46.67,33.59 45.08,34.62 30,26.05 15,34.54 -1.49,25.07
VDDA  (via drill 0.3 pad 0.55)
  Top 0.305: U3.7 13,24.32 C8.1 | U3.5 12.06,22.44 v11.86,22.24 | U3.4 10.16,22.71 v10.32,22.56
  Top 0.406: v10.32,22.56 9.86,22.56 9.61,22.31 7.08,22.31 6.34,23.04 FB1.1 | v11.86,25.53 12.1,25.53 12.32,25.3 12.46,25.3 13.11,24.65 C8.1
  Top 0.508: C8.1 C9.1
  Bottom 0.305: v11.86,22.24 11.62,22 C1.1 | v10.32,22.56 10.48,22.56 C2.1
  Bottom 0.406: v11.86,25.53 11.11,24.78 C4.1
  pour Bottom (no thermals): 10.48,26.77 10.48,20.73 11.67,19.54 12.7,19.54 13.02,19.23 13.02,18.83 14.21,18.83 14.21,19.3 13.09,20.42 11.98,20.42 11.82,20.57 11.82,26.77
VSSA  (via drill 0.35 pad 0.75, 0.65 pad 1.3)
  Top 0.254: U3.8 11.23,24.82 11.11,24.7 U3.9
  Bottom 0.305: C3.2 14.27,19.61 14.39,19.61 14.61,19.39 U1.7
  other vias: 34.92,19.7 36.59,19.7 38.26,19.7 39.84,19.7 41.51,19.7 43.1,19.7 32.07,18.11 33.73,18.11 35.32,18.11 36.91,18.11 38.42,18.11 39.84,18.11 41.51,18.11 43.1,18.11 46.11,18.11 46.11,16.69 43.1,16.61 41.51,16.69 39.84,16.69 38.42,16.61 36.91,16.61 35.4,16.61 33.81,16.61 32.14,16.61 35.24,15.18 36.75,15.18 38.42,15.18 40,15.18 41.59,15.18 43.1,15.18 44.69,18.11 44.69,16.69 25.64,11.61 26.11,10.34 32.38,23.99 31.19,23.35 13.65,25.73
  pour Bottom (no thermals): 13.49,20.81 13.49,25.42 14.68,25.42 14.68,26.85 12.38,26.85 12.38,20.81
  pour Top (rank 3, no thermals): 29.92,26.13 15.08,34.62 0.16,26.05 0.08,8.75 15,0.02 30,8.59 45,0.02 60.08,8.59 60.08,25.89 45.16,34.62 30,25.97 29.76,26.21
  pour Bottom (rank 3, no thermals): 26.19,28.12 21.83,24.54 21.83,15.57 25,11.61 26.43,6.6 29.92,8.59 44.92,0.1 59.93,8.67 60.01,25.97 45,34.62 30.08,26.05

### Text on the board
bPlace: H18R10
tNames: 3V3 | 3V3 | R | P2* | OUT4 | P1 | GND | 3V3 | 3V3 | 2A Max | OUT3 | P5 | B | 35V Max | C | 2A Max | OUT1 | 3V3 | VS | D | 3V3 | P4* | P3 | OUT2 | 3V3 | 3V3
bNames: GND | GND | P2* | OUT4 | GND | P1 | 2A Max | OUT3 | GND | P5 | GND | 35V Max | VS | GND | GND | 2A Max | P3 | P4* | OUT1 | GND | GND | OUT2